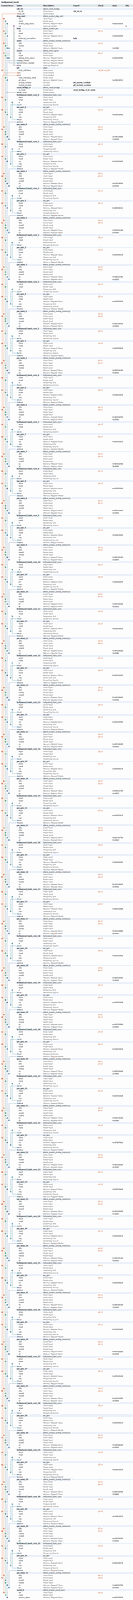
[diagram p0: system contents, whole]
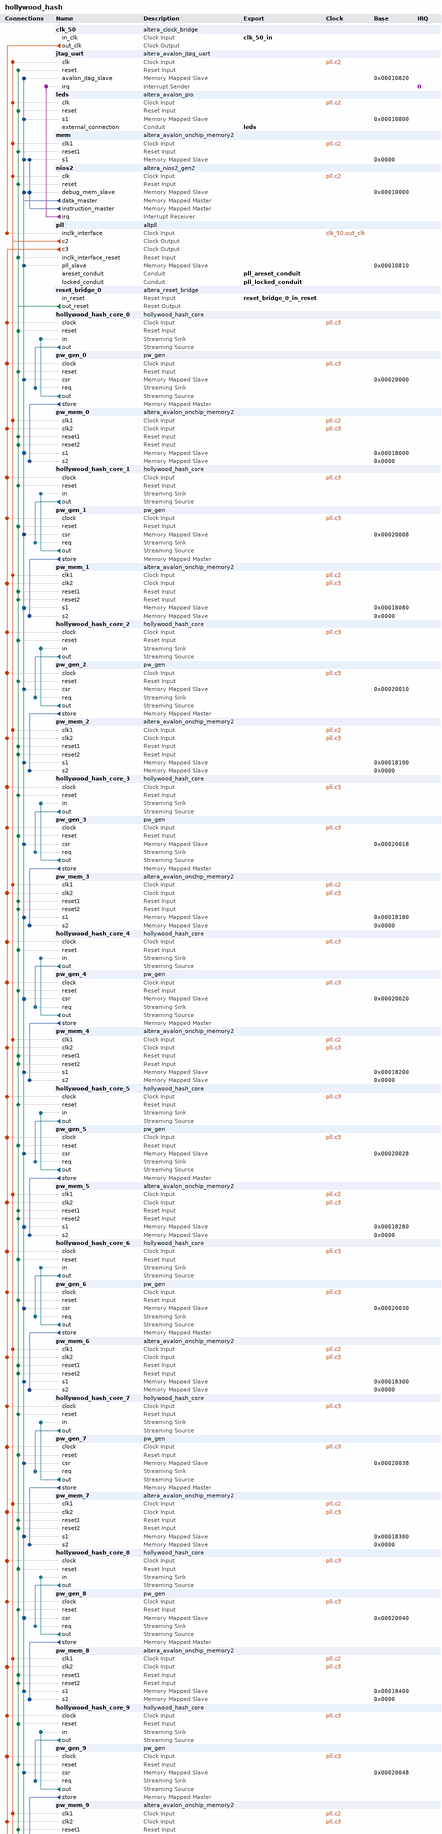
[diagram p1: system contents, upper part]
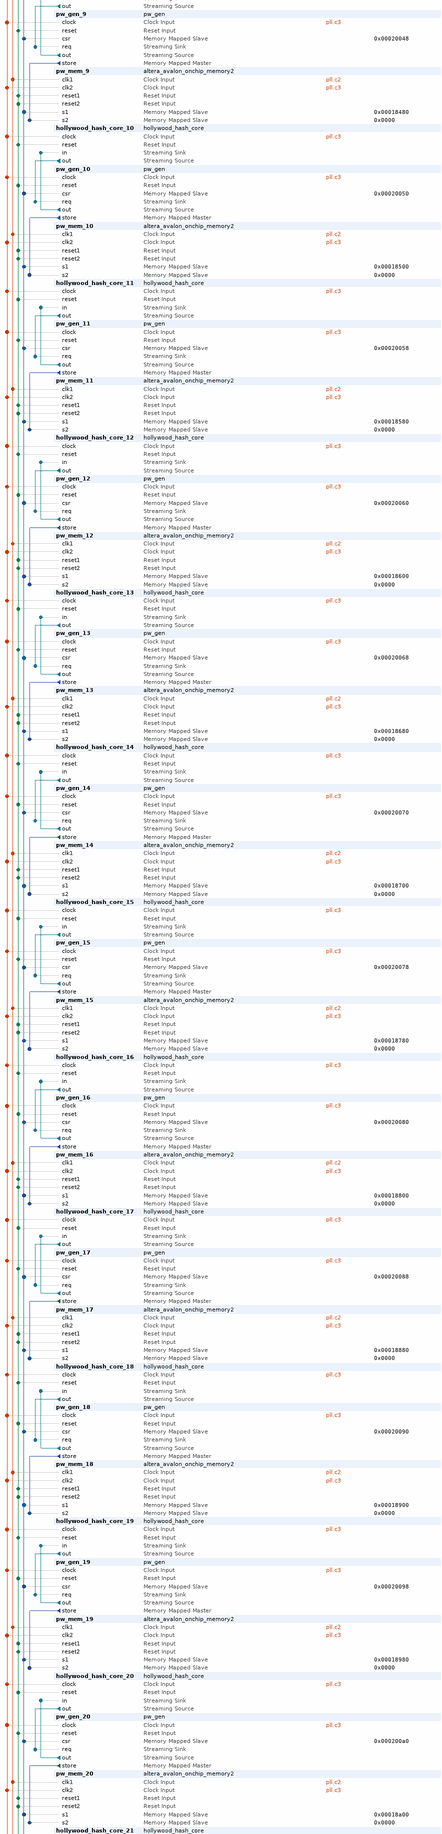
[diagram p2: system contents, middle part]
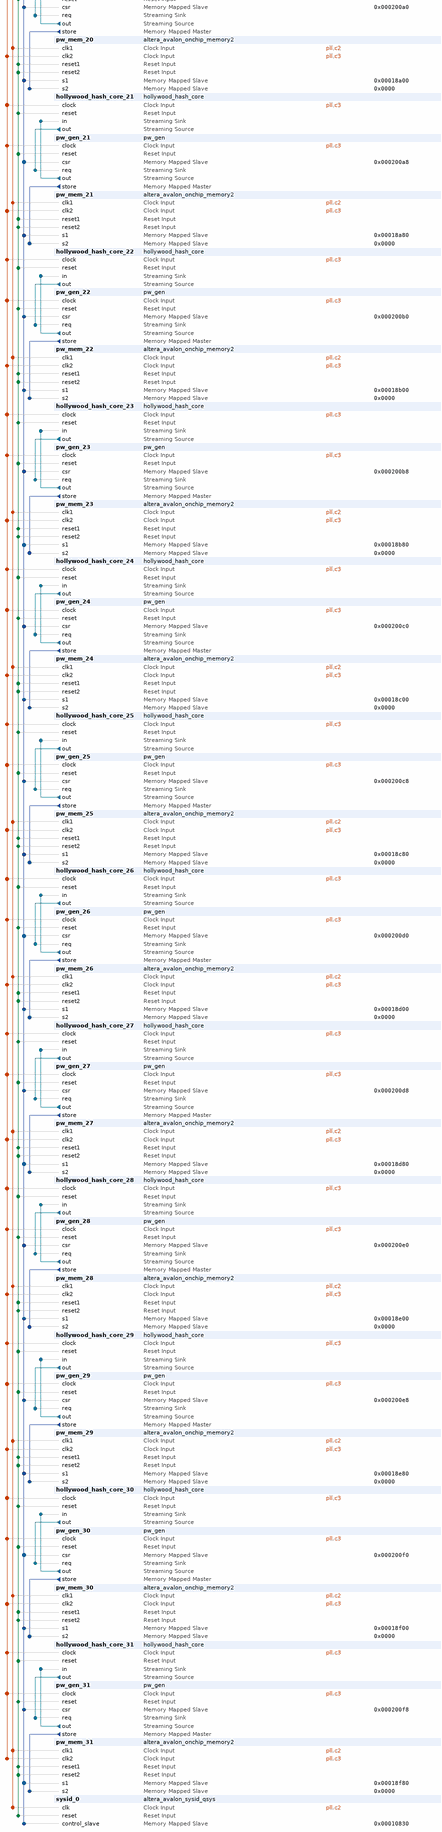
[diagram p3: system contents, lower part]
# Platform Designer (Qsys) system hollywood_hash, MAX 10 10M50DAF484C6GES
# Parameters at their usual value, and those the tool derives, are not listed.
package require -exact qsys 17.1
create_system hollywood_hash
set_project_property DEVICE_FAMILY {MAX 10}
set_project_property DEVICE 10M50DAF484C6GES

add_instance clk_50 altera_clock_bridge 17.1
set_instance_parameter_value clk_50 DERIVED_CLOCK_RATE 0
set_instance_parameter_value clk_50 EXPLICIT_CLOCK_RATE 50

add_instance jtag_uart altera_avalon_jtag_uart 17.1
set_instance_parameter_value jtag_uart simInteractiveOptions INTERACTIVE_ASCII_OUTPUT

add_instance leds altera_avalon_pio 17.1
set_instance_parameter_value leds direction Output
set_instance_parameter_value leds width 5

add_instance mem altera_avalon_onchip_memory2 17.1
set_instance_parameter_value mem dataWidth 32
set_instance_parameter_value mem dualPort false
set_instance_parameter_value mem initMemContent true
set_instance_parameter_value mem initializationFileName onchip_mem.hex
set_instance_parameter_value mem memorySize 32768
set_instance_parameter_value mem slave1Latency 2

add_instance nios2 altera_nios2_gen2 17.1
set_instance_parameter_value nios2 dcache_bursts true
set_instance_parameter_value nios2 dcache_size 4096
set_instance_parameter_value nios2 dividerType srt2
set_instance_parameter_value nios2 exceptionSlave mem.s1
set_instance_parameter_value nios2 icache_burstType Sequential
set_instance_parameter_value nios2 icache_size 16384
set_instance_parameter_value nios2 impl Tiny
set_instance_parameter_value nios2 mul_64_impl 1
set_instance_parameter_value nios2 resetSlave mem.s1

add_instance pll altpll 17.1
set_instance_parameter_value pll CLK0_DIVIDE_BY 5
set_instance_parameter_value pll CLK0_MULTIPLY_BY 1
set_instance_parameter_value pll CLK1_DIVIDE_BY 1
set_instance_parameter_value pll CLK1_DUTY_CYCLE 50
set_instance_parameter_value pll CLK1_MULTIPLY_BY 1
set_instance_parameter_value pll CLK1_PHASE_SHIFT 0
set_instance_parameter_value pll CLK2_DIVIDE_BY 1
set_instance_parameter_value pll CLK2_DUTY_CYCLE 50
set_instance_parameter_value pll CLK2_MULTIPLY_BY 1
set_instance_parameter_value pll CLK2_PHASE_SHIFT 0
set_instance_parameter_value pll CLK3_DIVIDE_BY 2
set_instance_parameter_value pll CLK3_DUTY_CYCLE 50
set_instance_parameter_value pll CLK3_MULTIPLY_BY 11
set_instance_parameter_value pll CLK3_PHASE_SHIFT 0
set_instance_parameter_value pll CLK4_DIVIDE_BY 5
set_instance_parameter_value pll CLK4_DUTY_CYCLE 50
set_instance_parameter_value pll CLK4_MULTIPLY_BY 2
set_instance_parameter_value pll CLK4_PHASE_SHIFT 5000
set_instance_parameter_value pll COMPENSATE_CLOCK CLK2
set_instance_parameter_value pll INCLK0_INPUT_FREQUENCY 20000
set_instance_parameter_value pll PORT_ARESET PORT_USED
set_instance_parameter_value pll PORT_LOCKED PORT_USED
set_instance_parameter_value pll PORT_clk0 PORT_UNUSED
set_instance_parameter_value pll PORT_clk1 PORT_UNUSED
set_instance_parameter_value pll PORT_clk2 PORT_USED
set_instance_parameter_value pll PORT_clk3 PORT_USED

add_instance reset_bridge_0 altera_reset_bridge 17.1
set_instance_parameter_value reset_bridge_0 ACTIVE_LOW_RESET 1
set_instance_parameter_value reset_bridge_0 SYNCHRONOUS_EDGES none

add_instance hollywood_hash_core_0 hollywood_hash_core 1.0
set_instance_parameter_value hollywood_hash_core_0 R4 65201
set_instance_parameter_value hollywood_hash_core_0 R6 37528

add_instance pw_gen_0 pw_gen 1.0
set_instance_parameter_value pw_gen_0 PW1_RESET 0
set_instance_parameter_value pw_gen_0 PW2_RESET 0
set_instance_parameter_value pw_gen_0 PW3_FINAL 7
set_instance_parameter_value pw_gen_0 PW3_RESET 0

add_instance pw_mem_0 altera_avalon_onchip_memory2 17.1
set_instance_parameter_value pw_mem_0 dataWidth 32
set_instance_parameter_value pw_mem_0 dualPort true
set_instance_parameter_value pw_mem_0 enableDiffWidth true
set_instance_parameter_value pw_mem_0 initMemContent false
set_instance_parameter_value pw_mem_0 initializationFileName onchip_mem.hex
set_instance_parameter_value pw_mem_0 memorySize 128
set_instance_parameter_value pw_mem_0 slave1Latency 2
set_instance_parameter_value pw_mem_0 slave2Latency 2

add_instance hollywood_hash_core_1 hollywood_hash_core 1.0
set_instance_parameter_value hollywood_hash_core_1 R4 65201
set_instance_parameter_value hollywood_hash_core_1 R6 37528

add_instance pw_gen_1 pw_gen 1.0
set_instance_parameter_value pw_gen_1 PW1_RESET 0
set_instance_parameter_value pw_gen_1 PW2_RESET 0
set_instance_parameter_value pw_gen_1 PW3_FINAL 15
set_instance_parameter_value pw_gen_1 PW3_RESET 8

add_instance pw_mem_1 altera_avalon_onchip_memory2 17.1
set_instance_parameter_value pw_mem_1 dataWidth 32
set_instance_parameter_value pw_mem_1 dualPort true
set_instance_parameter_value pw_mem_1 enableDiffWidth true
set_instance_parameter_value pw_mem_1 initMemContent false
set_instance_parameter_value pw_mem_1 initializationFileName onchip_mem.hex
set_instance_parameter_value pw_mem_1 memorySize 128
set_instance_parameter_value pw_mem_1 slave1Latency 2
set_instance_parameter_value pw_mem_1 slave2Latency 2

add_instance hollywood_hash_core_2 hollywood_hash_core 1.0
set_instance_parameter_value hollywood_hash_core_2 R4 65201
set_instance_parameter_value hollywood_hash_core_2 R6 37528

add_instance pw_gen_2 pw_gen 1.0
set_instance_parameter_value pw_gen_2 PW1_RESET 0
set_instance_parameter_value pw_gen_2 PW2_RESET 0
set_instance_parameter_value pw_gen_2 PW3_FINAL 23
set_instance_parameter_value pw_gen_2 PW3_RESET 16

add_instance pw_mem_2 altera_avalon_onchip_memory2 17.1
set_instance_parameter_value pw_mem_2 dataWidth 32
set_instance_parameter_value pw_mem_2 dualPort true
set_instance_parameter_value pw_mem_2 enableDiffWidth true
set_instance_parameter_value pw_mem_2 initMemContent false
set_instance_parameter_value pw_mem_2 initializationFileName onchip_mem.hex
set_instance_parameter_value pw_mem_2 memorySize 128
set_instance_parameter_value pw_mem_2 slave1Latency 2
set_instance_parameter_value pw_mem_2 slave2Latency 2

add_instance hollywood_hash_core_3 hollywood_hash_core 1.0
set_instance_parameter_value hollywood_hash_core_3 R4 65201
set_instance_parameter_value hollywood_hash_core_3 R6 37528

add_instance pw_gen_3 pw_gen 1.0
set_instance_parameter_value pw_gen_3 PW1_RESET 0
set_instance_parameter_value pw_gen_3 PW2_RESET 0
set_instance_parameter_value pw_gen_3 PW3_FINAL 31
set_instance_parameter_value pw_gen_3 PW3_RESET 24

add_instance pw_mem_3 altera_avalon_onchip_memory2 17.1
set_instance_parameter_value pw_mem_3 dataWidth 32
set_instance_parameter_value pw_mem_3 dualPort true
set_instance_parameter_value pw_mem_3 enableDiffWidth true
set_instance_parameter_value pw_mem_3 initMemContent false
set_instance_parameter_value pw_mem_3 initializationFileName onchip_mem.hex
set_instance_parameter_value pw_mem_3 memorySize 128
set_instance_parameter_value pw_mem_3 slave1Latency 2
set_instance_parameter_value pw_mem_3 slave2Latency 2

add_instance hollywood_hash_core_4 hollywood_hash_core 1.0
set_instance_parameter_value hollywood_hash_core_4 R4 65201
set_instance_parameter_value hollywood_hash_core_4 R6 37528

add_instance pw_gen_4 pw_gen 1.0
set_instance_parameter_value pw_gen_4 PW1_RESET 0
set_instance_parameter_value pw_gen_4 PW2_RESET 0
set_instance_parameter_value pw_gen_4 PW3_FINAL 39
set_instance_parameter_value pw_gen_4 PW3_RESET 32

add_instance pw_mem_4 altera_avalon_onchip_memory2 17.1
set_instance_parameter_value pw_mem_4 dataWidth 32
set_instance_parameter_value pw_mem_4 dualPort true
set_instance_parameter_value pw_mem_4 enableDiffWidth true
set_instance_parameter_value pw_mem_4 initMemContent false
set_instance_parameter_value pw_mem_4 initializationFileName onchip_mem.hex
set_instance_parameter_value pw_mem_4 memorySize 128
set_instance_parameter_value pw_mem_4 slave1Latency 2
set_instance_parameter_value pw_mem_4 slave2Latency 2

add_instance hollywood_hash_core_5 hollywood_hash_core 1.0
set_instance_parameter_value hollywood_hash_core_5 R4 65201
set_instance_parameter_value hollywood_hash_core_5 R6 37528

add_instance pw_gen_5 pw_gen 1.0
set_instance_parameter_value pw_gen_5 PW1_RESET 0
set_instance_parameter_value pw_gen_5 PW2_RESET 0
set_instance_parameter_value pw_gen_5 PW3_FINAL 47
set_instance_parameter_value pw_gen_5 PW3_RESET 40

add_instance pw_mem_5 altera_avalon_onchip_memory2 17.1
set_instance_parameter_value pw_mem_5 dataWidth 32
set_instance_parameter_value pw_mem_5 dualPort true
set_instance_parameter_value pw_mem_5 enableDiffWidth true
set_instance_parameter_value pw_mem_5 initMemContent false
set_instance_parameter_value pw_mem_5 initializationFileName onchip_mem.hex
set_instance_parameter_value pw_mem_5 memorySize 128
set_instance_parameter_value pw_mem_5 slave1Latency 2
set_instance_parameter_value pw_mem_5 slave2Latency 2

add_instance hollywood_hash_core_6 hollywood_hash_core 1.0
set_instance_parameter_value hollywood_hash_core_6 R4 65201
set_instance_parameter_value hollywood_hash_core_6 R6 37528

add_instance pw_gen_6 pw_gen 1.0
set_instance_parameter_value pw_gen_6 PW1_RESET 0
set_instance_parameter_value pw_gen_6 PW2_RESET 0
set_instance_parameter_value pw_gen_6 PW3_FINAL 55
set_instance_parameter_value pw_gen_6 PW3_RESET 48

add_instance pw_mem_6 altera_avalon_onchip_memory2 17.1
set_instance_parameter_value pw_mem_6 dataWidth 32
set_instance_parameter_value pw_mem_6 dualPort true
set_instance_parameter_value pw_mem_6 enableDiffWidth true
set_instance_parameter_value pw_mem_6 initMemContent false
set_instance_parameter_value pw_mem_6 initializationFileName onchip_mem.hex
set_instance_parameter_value pw_mem_6 memorySize 128
set_instance_parameter_value pw_mem_6 slave1Latency 2
set_instance_parameter_value pw_mem_6 slave2Latency 2

add_instance hollywood_hash_core_7 hollywood_hash_core 1.0
set_instance_parameter_value hollywood_hash_core_7 R4 65201
set_instance_parameter_value hollywood_hash_core_7 R6 37528

add_instance pw_gen_7 pw_gen 1.0
set_instance_parameter_value pw_gen_7 PW1_RESET 0
set_instance_parameter_value pw_gen_7 PW2_RESET 0
set_instance_parameter_value pw_gen_7 PW3_FINAL 63
set_instance_parameter_value pw_gen_7 PW3_RESET 56

add_instance pw_mem_7 altera_avalon_onchip_memory2 17.1
set_instance_parameter_value pw_mem_7 dataWidth 32
set_instance_parameter_value pw_mem_7 dualPort true
set_instance_parameter_value pw_mem_7 enableDiffWidth true
set_instance_parameter_value pw_mem_7 initMemContent false
set_instance_parameter_value pw_mem_7 initializationFileName onchip_mem.hex
set_instance_parameter_value pw_mem_7 memorySize 128
set_instance_parameter_value pw_mem_7 slave1Latency 2
set_instance_parameter_value pw_mem_7 slave2Latency 2

add_instance hollywood_hash_core_8 hollywood_hash_core 1.0
set_instance_parameter_value hollywood_hash_core_8 R4 65201
set_instance_parameter_value hollywood_hash_core_8 R6 37528

add_instance pw_gen_8 pw_gen 1.0
set_instance_parameter_value pw_gen_8 PW1_RESET 0
set_instance_parameter_value pw_gen_8 PW2_RESET 0
set_instance_parameter_value pw_gen_8 PW3_FINAL 71
set_instance_parameter_value pw_gen_8 PW3_RESET 64

add_instance pw_mem_8 altera_avalon_onchip_memory2 17.1
set_instance_parameter_value pw_mem_8 dataWidth 32
set_instance_parameter_value pw_mem_8 dualPort true
set_instance_parameter_value pw_mem_8 enableDiffWidth true
set_instance_parameter_value pw_mem_8 initMemContent false
set_instance_parameter_value pw_mem_8 initializationFileName onchip_mem.hex
set_instance_parameter_value pw_mem_8 memorySize 128
set_instance_parameter_value pw_mem_8 slave1Latency 2
set_instance_parameter_value pw_mem_8 slave2Latency 2

add_instance hollywood_hash_core_9 hollywood_hash_core 1.0
set_instance_parameter_value hollywood_hash_core_9 R4 65201
set_instance_parameter_value hollywood_hash_core_9 R6 37528

add_instance pw_gen_9 pw_gen 1.0
set_instance_parameter_value pw_gen_9 PW1_RESET 0
set_instance_parameter_value pw_gen_9 PW2_RESET 0
set_instance_parameter_value pw_gen_9 PW3_FINAL 79
set_instance_parameter_value pw_gen_9 PW3_RESET 72

add_instance pw_mem_9 altera_avalon_onchip_memory2 17.1
set_instance_parameter_value pw_mem_9 dataWidth 32
set_instance_parameter_value pw_mem_9 dualPort true
set_instance_parameter_value pw_mem_9 enableDiffWidth true
set_instance_parameter_value pw_mem_9 initMemContent false
set_instance_parameter_value pw_mem_9 initializationFileName onchip_mem.hex
set_instance_parameter_value pw_mem_9 memorySize 128
set_instance_parameter_value pw_mem_9 slave1Latency 2
set_instance_parameter_value pw_mem_9 slave2Latency 2

add_instance hollywood_hash_core_10 hollywood_hash_core 1.0
set_instance_parameter_value hollywood_hash_core_10 R4 65201
set_instance_parameter_value hollywood_hash_core_10 R6 37528

add_instance pw_gen_10 pw_gen 1.0
set_instance_parameter_value pw_gen_10 PW1_RESET 0
set_instance_parameter_value pw_gen_10 PW2_RESET 0
set_instance_parameter_value pw_gen_10 PW3_FINAL 87
set_instance_parameter_value pw_gen_10 PW3_RESET 80

add_instance pw_mem_10 altera_avalon_onchip_memory2 17.1
set_instance_parameter_value pw_mem_10 dataWidth 32
set_instance_parameter_value pw_mem_10 dualPort true
set_instance_parameter_value pw_mem_10 enableDiffWidth true
set_instance_parameter_value pw_mem_10 initMemContent false
set_instance_parameter_value pw_mem_10 initializationFileName onchip_mem.hex
set_instance_parameter_value pw_mem_10 memorySize 128
set_instance_parameter_value pw_mem_10 slave1Latency 2
set_instance_parameter_value pw_mem_10 slave2Latency 2

add_instance hollywood_hash_core_11 hollywood_hash_core 1.0
set_instance_parameter_value hollywood_hash_core_11 R4 65201
set_instance_parameter_value hollywood_hash_core_11 R6 37528

add_instance pw_gen_11 pw_gen 1.0
set_instance_parameter_value pw_gen_11 PW1_RESET 0
set_instance_parameter_value pw_gen_11 PW2_RESET 0
set_instance_parameter_value pw_gen_11 PW3_FINAL 95
set_instance_parameter_value pw_gen_11 PW3_RESET 88

add_instance pw_mem_11 altera_avalon_onchip_memory2 17.1
set_instance_parameter_value pw_mem_11 dataWidth 32
set_instance_parameter_value pw_mem_11 dualPort true
set_instance_parameter_value pw_mem_11 enableDiffWidth true
set_instance_parameter_value pw_mem_11 initMemContent false
set_instance_parameter_value pw_mem_11 initializationFileName onchip_mem.hex
set_instance_parameter_value pw_mem_11 memorySize 128
set_instance_parameter_value pw_mem_11 slave1Latency 2
set_instance_parameter_value pw_mem_11 slave2Latency 2

add_instance hollywood_hash_core_12 hollywood_hash_core 1.0
set_instance_parameter_value hollywood_hash_core_12 R4 65201
set_instance_parameter_value hollywood_hash_core_12 R6 37528

add_instance pw_gen_12 pw_gen 1.0
set_instance_parameter_value pw_gen_12 PW1_RESET 0
set_instance_parameter_value pw_gen_12 PW2_RESET 0
set_instance_parameter_value pw_gen_12 PW3_FINAL 103
set_instance_parameter_value pw_gen_12 PW3_RESET 96

add_instance pw_mem_12 altera_avalon_onchip_memory2 17.1
set_instance_parameter_value pw_mem_12 dataWidth 32
set_instance_parameter_value pw_mem_12 dualPort true
set_instance_parameter_value pw_mem_12 enableDiffWidth true
set_instance_parameter_value pw_mem_12 initMemContent false
set_instance_parameter_value pw_mem_12 initializationFileName onchip_mem.hex
set_instance_parameter_value pw_mem_12 memorySize 128
set_instance_parameter_value pw_mem_12 slave1Latency 2
set_instance_parameter_value pw_mem_12 slave2Latency 2

add_instance hollywood_hash_core_13 hollywood_hash_core 1.0
set_instance_parameter_value hollywood_hash_core_13 R4 65201
set_instance_parameter_value hollywood_hash_core_13 R6 37528

add_instance pw_gen_13 pw_gen 1.0
set_instance_parameter_value pw_gen_13 PW1_RESET 0
set_instance_parameter_value pw_gen_13 PW2_RESET 0
set_instance_parameter_value pw_gen_13 PW3_FINAL 111
set_instance_parameter_value pw_gen_13 PW3_RESET 104

add_instance pw_mem_13 altera_avalon_onchip_memory2 17.1
set_instance_parameter_value pw_mem_13 dataWidth 32
set_instance_parameter_value pw_mem_13 dualPort true
set_instance_parameter_value pw_mem_13 enableDiffWidth true
set_instance_parameter_value pw_mem_13 initMemContent false
set_instance_parameter_value pw_mem_13 initializationFileName onchip_mem.hex
set_instance_parameter_value pw_mem_13 memorySize 128
set_instance_parameter_value pw_mem_13 slave1Latency 2
set_instance_parameter_value pw_mem_13 slave2Latency 2

add_instance hollywood_hash_core_14 hollywood_hash_core 1.0
set_instance_parameter_value hollywood_hash_core_14 R4 65201
set_instance_parameter_value hollywood_hash_core_14 R6 37528

add_instance pw_gen_14 pw_gen 1.0
set_instance_parameter_value pw_gen_14 PW1_RESET 0
set_instance_parameter_value pw_gen_14 PW2_RESET 0
set_instance_parameter_value pw_gen_14 PW3_FINAL 119
set_instance_parameter_value pw_gen_14 PW3_RESET 112

add_instance pw_mem_14 altera_avalon_onchip_memory2 17.1
set_instance_parameter_value pw_mem_14 dataWidth 32
set_instance_parameter_value pw_mem_14 dualPort true
set_instance_parameter_value pw_mem_14 enableDiffWidth true
set_instance_parameter_value pw_mem_14 initMemContent false
set_instance_parameter_value pw_mem_14 initializationFileName onchip_mem.hex
set_instance_parameter_value pw_mem_14 memorySize 128
set_instance_parameter_value pw_mem_14 slave1Latency 2
set_instance_parameter_value pw_mem_14 slave2Latency 2

add_instance hollywood_hash_core_15 hollywood_hash_core 1.0
set_instance_parameter_value hollywood_hash_core_15 R4 65201
set_instance_parameter_value hollywood_hash_core_15 R6 37528

add_instance pw_gen_15 pw_gen 1.0
set_instance_parameter_value pw_gen_15 PW1_RESET 0
set_instance_parameter_value pw_gen_15 PW2_RESET 0
set_instance_parameter_value pw_gen_15 PW3_FINAL 127
set_instance_parameter_value pw_gen_15 PW3_RESET 120

add_instance pw_mem_15 altera_avalon_onchip_memory2 17.1
set_instance_parameter_value pw_mem_15 dataWidth 32
set_instance_parameter_value pw_mem_15 dualPort true
set_instance_parameter_value pw_mem_15 enableDiffWidth true
set_instance_parameter_value pw_mem_15 initMemContent false
set_instance_parameter_value pw_mem_15 initializationFileName onchip_mem.hex
set_instance_parameter_value pw_mem_15 memorySize 128
set_instance_parameter_value pw_mem_15 slave1Latency 2
set_instance_parameter_value pw_mem_15 slave2Latency 2

add_instance hollywood_hash_core_16 hollywood_hash_core 1.0
set_instance_parameter_value hollywood_hash_core_16 R4 65201
set_instance_parameter_value hollywood_hash_core_16 R6 37528

add_instance pw_gen_16 pw_gen 1.0
set_instance_parameter_value pw_gen_16 PW1_RESET 0
set_instance_parameter_value pw_gen_16 PW2_RESET 0
set_instance_parameter_value pw_gen_16 PW3_FINAL 135
set_instance_parameter_value pw_gen_16 PW3_RESET 128

add_instance pw_mem_16 altera_avalon_onchip_memory2 17.1
set_instance_parameter_value pw_mem_16 dataWidth 32
set_instance_parameter_value pw_mem_16 dualPort true
set_instance_parameter_value pw_mem_16 enableDiffWidth true
set_instance_parameter_value pw_mem_16 initMemContent false
set_instance_parameter_value pw_mem_16 initializationFileName onchip_mem.hex
set_instance_parameter_value pw_mem_16 memorySize 128
set_instance_parameter_value pw_mem_16 slave1Latency 2
set_instance_parameter_value pw_mem_16 slave2Latency 2

add_instance hollywood_hash_core_17 hollywood_hash_core 1.0
set_instance_parameter_value hollywood_hash_core_17 R4 65201
set_instance_parameter_value hollywood_hash_core_17 R6 37528

add_instance pw_gen_17 pw_gen 1.0
set_instance_parameter_value pw_gen_17 PW1_RESET 0
set_instance_parameter_value pw_gen_17 PW2_RESET 0
set_instance_parameter_value pw_gen_17 PW3_FINAL 143
set_instance_parameter_value pw_gen_17 PW3_RESET 136

add_instance pw_mem_17 altera_avalon_onchip_memory2 17.1
set_instance_parameter_value pw_mem_17 dataWidth 32
set_instance_parameter_value pw_mem_17 dualPort true
set_instance_parameter_value pw_mem_17 enableDiffWidth true
set_instance_parameter_value pw_mem_17 initMemContent false
set_instance_parameter_value pw_mem_17 initializationFileName onchip_mem.hex
set_instance_parameter_value pw_mem_17 memorySize 128
set_instance_parameter_value pw_mem_17 slave1Latency 2
set_instance_parameter_value pw_mem_17 slave2Latency 2

add_instance hollywood_hash_core_18 hollywood_hash_core 1.0
set_instance_parameter_value hollywood_hash_core_18 R4 65201
set_instance_parameter_value hollywood_hash_core_18 R6 37528

add_instance pw_gen_18 pw_gen 1.0
set_instance_parameter_value pw_gen_18 PW1_RESET 0
set_instance_parameter_value pw_gen_18 PW2_RESET 0
set_instance_parameter_value pw_gen_18 PW3_FINAL 151
set_instance_parameter_value pw_gen_18 PW3_RESET 144

add_instance pw_mem_18 altera_avalon_onchip_memory2 17.1
set_instance_parameter_value pw_mem_18 dataWidth 32
set_instance_parameter_value pw_mem_18 dualPort true
set_instance_parameter_value pw_mem_18 enableDiffWidth true
set_instance_parameter_value pw_mem_18 initMemContent false
set_instance_parameter_value pw_mem_18 initializationFileName onchip_mem.hex
set_instance_parameter_value pw_mem_18 memorySize 128
set_instance_parameter_value pw_mem_18 slave1Latency 2
set_instance_parameter_value pw_mem_18 slave2Latency 2

add_instance hollywood_hash_core_19 hollywood_hash_core 1.0
set_instance_parameter_value hollywood_hash_core_19 R4 65201
set_instance_parameter_value hollywood_hash_core_19 R6 37528

add_instance pw_gen_19 pw_gen 1.0
set_instance_parameter_value pw_gen_19 PW1_RESET 0
set_instance_parameter_value pw_gen_19 PW2_RESET 0
set_instance_parameter_value pw_gen_19 PW3_FINAL 159
set_instance_parameter_value pw_gen_19 PW3_RESET 152

add_instance pw_mem_19 altera_avalon_onchip_memory2 17.1
set_instance_parameter_value pw_mem_19 dataWidth 32
set_instance_parameter_value pw_mem_19 dualPort true
set_instance_parameter_value pw_mem_19 enableDiffWidth true
set_instance_parameter_value pw_mem_19 initMemContent false
set_instance_parameter_value pw_mem_19 initializationFileName onchip_mem.hex
set_instance_parameter_value pw_mem_19 memorySize 128
set_instance_parameter_value pw_mem_19 slave1Latency 2
set_instance_parameter_value pw_mem_19 slave2Latency 2

add_instance hollywood_hash_core_20 hollywood_hash_core 1.0
set_instance_parameter_value hollywood_hash_core_20 R4 65201
set_instance_parameter_value hollywood_hash_core_20 R6 37528

add_instance pw_gen_20 pw_gen 1.0
set_instance_parameter_value pw_gen_20 PW1_RESET 0
set_instance_parameter_value pw_gen_20 PW2_RESET 0
set_instance_parameter_value pw_gen_20 PW3_FINAL 167
set_instance_parameter_value pw_gen_20 PW3_RESET 160

add_instance pw_mem_20 altera_avalon_onchip_memory2 17.1
set_instance_parameter_value pw_mem_20 dataWidth 32
set_instance_parameter_value pw_mem_20 dualPort true
set_instance_parameter_value pw_mem_20 enableDiffWidth true
set_instance_parameter_value pw_mem_20 initMemContent false
set_instance_parameter_value pw_mem_20 initializationFileName onchip_mem.hex
set_instance_parameter_value pw_mem_20 memorySize 128
set_instance_parameter_value pw_mem_20 slave1Latency 2
set_instance_parameter_value pw_mem_20 slave2Latency 2

add_instance hollywood_hash_core_21 hollywood_hash_core 1.0
set_instance_parameter_value hollywood_hash_core_21 R4 65201
set_instance_parameter_value hollywood_hash_core_21 R6 37528

add_instance pw_gen_21 pw_gen 1.0
set_instance_parameter_value pw_gen_21 PW1_RESET 0
set_instance_parameter_value pw_gen_21 PW2_RESET 0
set_instance_parameter_value pw_gen_21 PW3_FINAL 175
set_instance_parameter_value pw_gen_21 PW3_RESET 168

add_instance pw_mem_21 altera_avalon_onchip_memory2 17.1
set_instance_parameter_value pw_mem_21 dataWidth 32
set_instance_parameter_value pw_mem_21 dualPort true
set_instance_parameter_value pw_mem_21 enableDiffWidth true
set_instance_parameter_value pw_mem_21 initMemContent false
set_instance_parameter_value pw_mem_21 initializationFileName onchip_mem.hex
set_instance_parameter_value pw_mem_21 memorySize 128
set_instance_parameter_value pw_mem_21 slave1Latency 2
set_instance_parameter_value pw_mem_21 slave2Latency 2

add_instance hollywood_hash_core_22 hollywood_hash_core 1.0
set_instance_parameter_value hollywood_hash_core_22 R4 65201
set_instance_parameter_value hollywood_hash_core_22 R6 37528

add_instance pw_gen_22 pw_gen 1.0
set_instance_parameter_value pw_gen_22 PW1_RESET 0
set_instance_parameter_value pw_gen_22 PW2_RESET 0
set_instance_parameter_value pw_gen_22 PW3_FINAL 183
set_instance_parameter_value pw_gen_22 PW3_RESET 176

add_instance pw_mem_22 altera_avalon_onchip_memory2 17.1
set_instance_parameter_value pw_mem_22 dataWidth 32
set_instance_parameter_value pw_mem_22 dualPort true
set_instance_parameter_value pw_mem_22 enableDiffWidth true
set_instance_parameter_value pw_mem_22 initMemContent false
set_instance_parameter_value pw_mem_22 initializationFileName onchip_mem.hex
set_instance_parameter_value pw_mem_22 memorySize 128
set_instance_parameter_value pw_mem_22 slave1Latency 2
set_instance_parameter_value pw_mem_22 slave2Latency 2

add_instance hollywood_hash_core_23 hollywood_hash_core 1.0
set_instance_parameter_value hollywood_hash_core_23 R4 65201
set_instance_parameter_value hollywood_hash_core_23 R6 37528

add_instance pw_gen_23 pw_gen 1.0
set_instance_parameter_value pw_gen_23 PW1_RESET 0
set_instance_parameter_value pw_gen_23 PW2_RESET 0
set_instance_parameter_value pw_gen_23 PW3_FINAL 191
set_instance_parameter_value pw_gen_23 PW3_RESET 184

add_instance pw_mem_23 altera_avalon_onchip_memory2 17.1
set_instance_parameter_value pw_mem_23 dataWidth 32
set_instance_parameter_value pw_mem_23 dualPort true
set_instance_parameter_value pw_mem_23 enableDiffWidth true
set_instance_parameter_value pw_mem_23 initMemContent false
set_instance_parameter_value pw_mem_23 initializationFileName onchip_mem.hex
set_instance_parameter_value pw_mem_23 memorySize 128
set_instance_parameter_value pw_mem_23 slave1Latency 2
set_instance_parameter_value pw_mem_23 slave2Latency 2

add_instance hollywood_hash_core_24 hollywood_hash_core 1.0
set_instance_parameter_value hollywood_hash_core_24 R4 65201
set_instance_parameter_value hollywood_hash_core_24 R6 37528

add_instance pw_gen_24 pw_gen 1.0
set_instance_parameter_value pw_gen_24 PW1_RESET 0
set_instance_parameter_value pw_gen_24 PW2_RESET 0
set_instance_parameter_value pw_gen_24 PW3_FINAL 199
set_instance_parameter_value pw_gen_24 PW3_RESET 192

add_instance pw_mem_24 altera_avalon_onchip_memory2 17.1
set_instance_parameter_value pw_mem_24 dataWidth 32
set_instance_parameter_value pw_mem_24 dualPort true
set_instance_parameter_value pw_mem_24 enableDiffWidth true
set_instance_parameter_value pw_mem_24 initMemContent false
set_instance_parameter_value pw_mem_24 initializationFileName onchip_mem.hex
set_instance_parameter_value pw_mem_24 memorySize 128
set_instance_parameter_value pw_mem_24 slave1Latency 2
set_instance_parameter_value pw_mem_24 slave2Latency 2

add_instance hollywood_hash_core_25 hollywood_hash_core 1.0
set_instance_parameter_value hollywood_hash_core_25 R4 65201
set_instance_parameter_value hollywood_hash_core_25 R6 37528

add_instance pw_gen_25 pw_gen 1.0
set_instance_parameter_value pw_gen_25 PW1_RESET 0
set_instance_parameter_value pw_gen_25 PW2_RESET 0
set_instance_parameter_value pw_gen_25 PW3_FINAL 207
set_instance_parameter_value pw_gen_25 PW3_RESET 200

add_instance pw_mem_25 altera_avalon_onchip_memory2 17.1
set_instance_parameter_value pw_mem_25 dataWidth 32
set_instance_parameter_value pw_mem_25 dualPort true
set_instance_parameter_value pw_mem_25 enableDiffWidth true
set_instance_parameter_value pw_mem_25 initMemContent false
set_instance_parameter_value pw_mem_25 initializationFileName onchip_mem.hex
set_instance_parameter_value pw_mem_25 memorySize 128
set_instance_parameter_value pw_mem_25 slave1Latency 2
set_instance_parameter_value pw_mem_25 slave2Latency 2

add_instance hollywood_hash_core_26 hollywood_hash_core 1.0
set_instance_parameter_value hollywood_hash_core_26 R4 65201
set_instance_parameter_value hollywood_hash_core_26 R6 37528

add_instance pw_gen_26 pw_gen 1.0
set_instance_parameter_value pw_gen_26 PW1_RESET 0
set_instance_parameter_value pw_gen_26 PW2_RESET 0
set_instance_parameter_value pw_gen_26 PW3_FINAL 215
set_instance_parameter_value pw_gen_26 PW3_RESET 208

add_instance pw_mem_26 altera_avalon_onchip_memory2 17.1
set_instance_parameter_value pw_mem_26 dataWidth 32
set_instance_parameter_value pw_mem_26 dualPort true
set_instance_parameter_value pw_mem_26 enableDiffWidth true
set_instance_parameter_value pw_mem_26 initMemContent false
set_instance_parameter_value pw_mem_26 initializationFileName onchip_mem.hex
set_instance_parameter_value pw_mem_26 memorySize 128
set_instance_parameter_value pw_mem_26 slave1Latency 2
set_instance_parameter_value pw_mem_26 slave2Latency 2

add_instance hollywood_hash_core_27 hollywood_hash_core 1.0
set_instance_parameter_value hollywood_hash_core_27 R4 65201
set_instance_parameter_value hollywood_hash_core_27 R6 37528

add_instance pw_gen_27 pw_gen 1.0
set_instance_parameter_value pw_gen_27 PW1_RESET 0
set_instance_parameter_value pw_gen_27 PW2_RESET 0
set_instance_parameter_value pw_gen_27 PW3_FINAL 223
set_instance_parameter_value pw_gen_27 PW3_RESET 216

add_instance pw_mem_27 altera_avalon_onchip_memory2 17.1
set_instance_parameter_value pw_mem_27 dataWidth 32
set_instance_parameter_value pw_mem_27 dualPort true
set_instance_parameter_value pw_mem_27 enableDiffWidth true
set_instance_parameter_value pw_mem_27 initMemContent false
set_instance_parameter_value pw_mem_27 initializationFileName onchip_mem.hex
set_instance_parameter_value pw_mem_27 memorySize 128
set_instance_parameter_value pw_mem_27 slave1Latency 2
set_instance_parameter_value pw_mem_27 slave2Latency 2

add_instance hollywood_hash_core_28 hollywood_hash_core 1.0
set_instance_parameter_value hollywood_hash_core_28 R4 65201
set_instance_parameter_value hollywood_hash_core_28 R6 37528

add_instance pw_gen_28 pw_gen 1.0
set_instance_parameter_value pw_gen_28 PW1_RESET 0
set_instance_parameter_value pw_gen_28 PW2_RESET 0
set_instance_parameter_value pw_gen_28 PW3_FINAL 231
set_instance_parameter_value pw_gen_28 PW3_RESET 224

add_instance pw_mem_28 altera_avalon_onchip_memory2 17.1
set_instance_parameter_value pw_mem_28 dataWidth 32
set_instance_parameter_value pw_mem_28 dualPort true
set_instance_parameter_value pw_mem_28 enableDiffWidth true
set_instance_parameter_value pw_mem_28 initMemContent false
set_instance_parameter_value pw_mem_28 initializationFileName onchip_mem.hex
set_instance_parameter_value pw_mem_28 memorySize 128
set_instance_parameter_value pw_mem_28 slave1Latency 2
set_instance_parameter_value pw_mem_28 slave2Latency 2

add_instance hollywood_hash_core_29 hollywood_hash_core 1.0
set_instance_parameter_value hollywood_hash_core_29 R4 65201
set_instance_parameter_value hollywood_hash_core_29 R6 37528

add_instance pw_gen_29 pw_gen 1.0
set_instance_parameter_value pw_gen_29 PW1_RESET 0
set_instance_parameter_value pw_gen_29 PW2_RESET 0
set_instance_parameter_value pw_gen_29 PW3_FINAL 239
set_instance_parameter_value pw_gen_29 PW3_RESET 232

add_instance pw_mem_29 altera_avalon_onchip_memory2 17.1
set_instance_parameter_value pw_mem_29 dataWidth 32
set_instance_parameter_value pw_mem_29 dualPort true
set_instance_parameter_value pw_mem_29 enableDiffWidth true
set_instance_parameter_value pw_mem_29 initMemContent false
set_instance_parameter_value pw_mem_29 initializationFileName onchip_mem.hex
set_instance_parameter_value pw_mem_29 memorySize 128
set_instance_parameter_value pw_mem_29 slave1Latency 2
set_instance_parameter_value pw_mem_29 slave2Latency 2

add_instance hollywood_hash_core_30 hollywood_hash_core 1.0
set_instance_parameter_value hollywood_hash_core_30 R4 65201
set_instance_parameter_value hollywood_hash_core_30 R6 37528

add_instance pw_gen_30 pw_gen 1.0
set_instance_parameter_value pw_gen_30 PW1_RESET 0
set_instance_parameter_value pw_gen_30 PW2_RESET 0
set_instance_parameter_value pw_gen_30 PW3_FINAL 247
set_instance_parameter_value pw_gen_30 PW3_RESET 240

add_instance pw_mem_30 altera_avalon_onchip_memory2 17.1
set_instance_parameter_value pw_mem_30 dataWidth 32
set_instance_parameter_value pw_mem_30 dualPort true
set_instance_parameter_value pw_mem_30 enableDiffWidth true
set_instance_parameter_value pw_mem_30 initMemContent false
set_instance_parameter_value pw_mem_30 initializationFileName onchip_mem.hex
set_instance_parameter_value pw_mem_30 memorySize 128
set_instance_parameter_value pw_mem_30 slave1Latency 2
set_instance_parameter_value pw_mem_30 slave2Latency 2

add_instance hollywood_hash_core_31 hollywood_hash_core 1.0
set_instance_parameter_value hollywood_hash_core_31 R4 65201
set_instance_parameter_value hollywood_hash_core_31 R6 37528

add_instance pw_gen_31 pw_gen 1.0
set_instance_parameter_value pw_gen_31 PW1_RESET 0
set_instance_parameter_value pw_gen_31 PW2_RESET 0
set_instance_parameter_value pw_gen_31 PW3_FINAL 255
set_instance_parameter_value pw_gen_31 PW3_RESET 248

add_instance pw_mem_31 altera_avalon_onchip_memory2 17.1
set_instance_parameter_value pw_mem_31 dataWidth 32
set_instance_parameter_value pw_mem_31 dualPort true
set_instance_parameter_value pw_mem_31 enableDiffWidth true
set_instance_parameter_value pw_mem_31 initMemContent false
set_instance_parameter_value pw_mem_31 initializationFileName onchip_mem.hex
set_instance_parameter_value pw_mem_31 memorySize 128
set_instance_parameter_value pw_mem_31 slave1Latency 2
set_instance_parameter_value pw_mem_31 slave2Latency 2

add_instance sysid_0 altera_avalon_sysid_qsys 17.1
set_instance_parameter_value sysid_0 id -21917032

# connections
add_connection clk_50.out_clk pll.inclk_interface clock
add_connection pll.c2 jtag_uart.clk clock
add_connection pll.c2 leds.clk clock
add_connection pll.c2 mem.clk1 clock
add_connection pll.c2 nios2.clk clock
add_connection pll.c2 pw_mem_0.clk1 clock
add_connection pll.c2 pw_mem_1.clk1 clock
add_connection pll.c2 pw_mem_2.clk1 clock
add_connection pll.c2 pw_mem_3.clk1 clock
add_connection pll.c2 pw_mem_4.clk1 clock
add_connection pll.c2 pw_mem_5.clk1 clock
add_connection pll.c2 pw_mem_6.clk1 clock
add_connection pll.c2 pw_mem_7.clk1 clock
add_connection pll.c2 pw_mem_8.clk1 clock
add_connection pll.c2 pw_mem_9.clk1 clock
add_connection pll.c2 pw_mem_10.clk1 clock
add_connection pll.c2 pw_mem_11.clk1 clock
add_connection pll.c2 pw_mem_12.clk1 clock
add_connection pll.c2 pw_mem_13.clk1 clock
add_connection pll.c2 pw_mem_14.clk1 clock
add_connection pll.c2 pw_mem_15.clk1 clock
add_connection pll.c2 pw_mem_16.clk1 clock
add_connection pll.c2 pw_mem_17.clk1 clock
add_connection pll.c2 pw_mem_18.clk1 clock
add_connection pll.c2 pw_mem_19.clk1 clock
add_connection pll.c2 pw_mem_20.clk1 clock
add_connection pll.c2 pw_mem_21.clk1 clock
add_connection pll.c2 pw_mem_22.clk1 clock
add_connection pll.c2 pw_mem_23.clk1 clock
add_connection pll.c2 pw_mem_24.clk1 clock
add_connection pll.c2 pw_mem_25.clk1 clock
add_connection pll.c2 pw_mem_26.clk1 clock
add_connection pll.c2 pw_mem_27.clk1 clock
add_connection pll.c2 pw_mem_28.clk1 clock
add_connection pll.c2 pw_mem_29.clk1 clock
add_connection pll.c2 pw_mem_30.clk1 clock
add_connection pll.c2 pw_mem_31.clk1 clock
add_connection pll.c2 sysid_0.clk clock
add_connection pll.c3 hollywood_hash_core_0.clock clock
add_connection pll.c3 hollywood_hash_core_1.clock clock
add_connection pll.c3 hollywood_hash_core_2.clock clock
add_connection pll.c3 hollywood_hash_core_3.clock clock
add_connection pll.c3 hollywood_hash_core_4.clock clock
add_connection pll.c3 hollywood_hash_core_5.clock clock
add_connection pll.c3 hollywood_hash_core_6.clock clock
add_connection pll.c3 hollywood_hash_core_7.clock clock
add_connection pll.c3 hollywood_hash_core_8.clock clock
add_connection pll.c3 hollywood_hash_core_9.clock clock
add_connection pll.c3 hollywood_hash_core_10.clock clock
add_connection pll.c3 hollywood_hash_core_11.clock clock
add_connection pll.c3 hollywood_hash_core_12.clock clock
add_connection pll.c3 hollywood_hash_core_13.clock clock
add_connection pll.c3 hollywood_hash_core_14.clock clock
add_connection pll.c3 hollywood_hash_core_15.clock clock
add_connection pll.c3 hollywood_hash_core_16.clock clock
add_connection pll.c3 hollywood_hash_core_17.clock clock
add_connection pll.c3 hollywood_hash_core_18.clock clock
add_connection pll.c3 hollywood_hash_core_19.clock clock
add_connection pll.c3 hollywood_hash_core_20.clock clock
add_connection pll.c3 hollywood_hash_core_21.clock clock
add_connection pll.c3 hollywood_hash_core_22.clock clock
add_connection pll.c3 hollywood_hash_core_23.clock clock
add_connection pll.c3 hollywood_hash_core_24.clock clock
add_connection pll.c3 hollywood_hash_core_25.clock clock
add_connection pll.c3 hollywood_hash_core_26.clock clock
add_connection pll.c3 hollywood_hash_core_27.clock clock
add_connection pll.c3 hollywood_hash_core_28.clock clock
add_connection pll.c3 hollywood_hash_core_29.clock clock
add_connection pll.c3 hollywood_hash_core_30.clock clock
add_connection pll.c3 hollywood_hash_core_31.clock clock
add_connection pll.c3 pw_gen_0.clock clock
add_connection pll.c3 pw_gen_1.clock clock
add_connection pll.c3 pw_gen_2.clock clock
add_connection pll.c3 pw_gen_3.clock clock
add_connection pll.c3 pw_gen_4.clock clock
add_connection pll.c3 pw_gen_5.clock clock
add_connection pll.c3 pw_gen_6.clock clock
add_connection pll.c3 pw_gen_7.clock clock
add_connection pll.c3 pw_gen_8.clock clock
add_connection pll.c3 pw_gen_9.clock clock
add_connection pll.c3 pw_gen_10.clock clock
add_connection pll.c3 pw_gen_11.clock clock
add_connection pll.c3 pw_gen_12.clock clock
add_connection pll.c3 pw_gen_13.clock clock
add_connection pll.c3 pw_gen_14.clock clock
add_connection pll.c3 pw_gen_15.clock clock
add_connection pll.c3 pw_gen_16.clock clock
add_connection pll.c3 pw_gen_17.clock clock
add_connection pll.c3 pw_gen_18.clock clock
add_connection pll.c3 pw_gen_19.clock clock
add_connection pll.c3 pw_gen_20.clock clock
add_connection pll.c3 pw_gen_21.clock clock
add_connection pll.c3 pw_gen_22.clock clock
add_connection pll.c3 pw_gen_23.clock clock
add_connection pll.c3 pw_gen_24.clock clock
add_connection pll.c3 pw_gen_25.clock clock
add_connection pll.c3 pw_gen_26.clock clock
add_connection pll.c3 pw_gen_27.clock clock
add_connection pll.c3 pw_gen_28.clock clock
add_connection pll.c3 pw_gen_29.clock clock
add_connection pll.c3 pw_gen_30.clock clock
add_connection pll.c3 pw_gen_31.clock clock
add_connection pll.c3 pw_mem_0.clk2 clock
add_connection pll.c3 pw_mem_1.clk2 clock
add_connection pll.c3 pw_mem_2.clk2 clock
add_connection pll.c3 pw_mem_3.clk2 clock
add_connection pll.c3 pw_mem_4.clk2 clock
add_connection pll.c3 pw_mem_5.clk2 clock
add_connection pll.c3 pw_mem_6.clk2 clock
add_connection pll.c3 pw_mem_7.clk2 clock
add_connection pll.c3 pw_mem_8.clk2 clock
add_connection pll.c3 pw_mem_9.clk2 clock
add_connection pll.c3 pw_mem_10.clk2 clock
add_connection pll.c3 pw_mem_11.clk2 clock
add_connection pll.c3 pw_mem_12.clk2 clock
add_connection pll.c3 pw_mem_13.clk2 clock
add_connection pll.c3 pw_mem_14.clk2 clock
add_connection pll.c3 pw_mem_15.clk2 clock
add_connection pll.c3 pw_mem_16.clk2 clock
add_connection pll.c3 pw_mem_17.clk2 clock
add_connection pll.c3 pw_mem_18.clk2 clock
add_connection pll.c3 pw_mem_19.clk2 clock
add_connection pll.c3 pw_mem_20.clk2 clock
add_connection pll.c3 pw_mem_21.clk2 clock
add_connection pll.c3 pw_mem_22.clk2 clock
add_connection pll.c3 pw_mem_23.clk2 clock
add_connection pll.c3 pw_mem_24.clk2 clock
add_connection pll.c3 pw_mem_25.clk2 clock
add_connection pll.c3 pw_mem_26.clk2 clock
add_connection pll.c3 pw_mem_27.clk2 clock
add_connection pll.c3 pw_mem_28.clk2 clock
add_connection pll.c3 pw_mem_29.clk2 clock
add_connection pll.c3 pw_mem_30.clk2 clock
add_connection pll.c3 pw_mem_31.clk2 clock
add_connection reset_bridge_0.out_reset hollywood_hash_core_0.reset reset
add_connection reset_bridge_0.out_reset hollywood_hash_core_1.reset reset
add_connection reset_bridge_0.out_reset hollywood_hash_core_2.reset reset
add_connection reset_bridge_0.out_reset hollywood_hash_core_3.reset reset
add_connection reset_bridge_0.out_reset hollywood_hash_core_4.reset reset
add_connection reset_bridge_0.out_reset hollywood_hash_core_5.reset reset
add_connection reset_bridge_0.out_reset hollywood_hash_core_6.reset reset
add_connection reset_bridge_0.out_reset hollywood_hash_core_7.reset reset
add_connection reset_bridge_0.out_reset hollywood_hash_core_8.reset reset
add_connection reset_bridge_0.out_reset hollywood_hash_core_9.reset reset
add_connection reset_bridge_0.out_reset hollywood_hash_core_10.reset reset
add_connection reset_bridge_0.out_reset hollywood_hash_core_11.reset reset
add_connection reset_bridge_0.out_reset hollywood_hash_core_12.reset reset
add_connection reset_bridge_0.out_reset hollywood_hash_core_13.reset reset
add_connection reset_bridge_0.out_reset hollywood_hash_core_14.reset reset
add_connection reset_bridge_0.out_reset hollywood_hash_core_15.reset reset
add_connection reset_bridge_0.out_reset hollywood_hash_core_16.reset reset
add_connection reset_bridge_0.out_reset hollywood_hash_core_17.reset reset
add_connection reset_bridge_0.out_reset hollywood_hash_core_18.reset reset
add_connection reset_bridge_0.out_reset hollywood_hash_core_19.reset reset
add_connection reset_bridge_0.out_reset hollywood_hash_core_20.reset reset
add_connection reset_bridge_0.out_reset hollywood_hash_core_21.reset reset
add_connection reset_bridge_0.out_reset hollywood_hash_core_22.reset reset
add_connection reset_bridge_0.out_reset hollywood_hash_core_23.reset reset
add_connection reset_bridge_0.out_reset hollywood_hash_core_24.reset reset
add_connection reset_bridge_0.out_reset hollywood_hash_core_25.reset reset
add_connection reset_bridge_0.out_reset hollywood_hash_core_26.reset reset
add_connection reset_bridge_0.out_reset hollywood_hash_core_27.reset reset
add_connection reset_bridge_0.out_reset hollywood_hash_core_28.reset reset
add_connection reset_bridge_0.out_reset hollywood_hash_core_29.reset reset
add_connection reset_bridge_0.out_reset hollywood_hash_core_30.reset reset
add_connection reset_bridge_0.out_reset hollywood_hash_core_31.reset reset
add_connection reset_bridge_0.out_reset jtag_uart.reset reset
add_connection reset_bridge_0.out_reset leds.reset reset
add_connection reset_bridge_0.out_reset mem.reset1 reset
add_connection reset_bridge_0.out_reset nios2.reset reset
add_connection reset_bridge_0.out_reset pll.inclk_interface_reset reset
add_connection reset_bridge_0.out_reset pw_gen_0.reset reset
add_connection reset_bridge_0.out_reset pw_gen_1.reset reset
add_connection reset_bridge_0.out_reset pw_gen_2.reset reset
add_connection reset_bridge_0.out_reset pw_gen_3.reset reset
add_connection reset_bridge_0.out_reset pw_gen_4.reset reset
add_connection reset_bridge_0.out_reset pw_gen_5.reset reset
add_connection reset_bridge_0.out_reset pw_gen_6.reset reset
add_connection reset_bridge_0.out_reset pw_gen_7.reset reset
add_connection reset_bridge_0.out_reset pw_gen_8.reset reset
add_connection reset_bridge_0.out_reset pw_gen_9.reset reset
add_connection reset_bridge_0.out_reset pw_gen_10.reset reset
add_connection reset_bridge_0.out_reset pw_gen_11.reset reset
add_connection reset_bridge_0.out_reset pw_gen_12.reset reset
add_connection reset_bridge_0.out_reset pw_gen_13.reset reset
add_connection reset_bridge_0.out_reset pw_gen_14.reset reset
add_connection reset_bridge_0.out_reset pw_gen_15.reset reset
add_connection reset_bridge_0.out_reset pw_gen_16.reset reset
add_connection reset_bridge_0.out_reset pw_gen_17.reset reset
add_connection reset_bridge_0.out_reset pw_gen_18.reset reset
add_connection reset_bridge_0.out_reset pw_gen_19.reset reset
add_connection reset_bridge_0.out_reset pw_gen_20.reset reset
add_connection reset_bridge_0.out_reset pw_gen_21.reset reset
add_connection reset_bridge_0.out_reset pw_gen_22.reset reset
add_connection reset_bridge_0.out_reset pw_gen_23.reset reset
add_connection reset_bridge_0.out_reset pw_gen_24.reset reset
add_connection reset_bridge_0.out_reset pw_gen_25.reset reset
add_connection reset_bridge_0.out_reset pw_gen_26.reset reset
add_connection reset_bridge_0.out_reset pw_gen_27.reset reset
add_connection reset_bridge_0.out_reset pw_gen_28.reset reset
add_connection reset_bridge_0.out_reset pw_gen_29.reset reset
add_connection reset_bridge_0.out_reset pw_gen_30.reset reset
add_connection reset_bridge_0.out_reset pw_gen_31.reset reset
add_connection reset_bridge_0.out_reset pw_mem_0.reset1 reset
add_connection reset_bridge_0.out_reset pw_mem_0.reset2 reset
add_connection reset_bridge_0.out_reset pw_mem_1.reset1 reset
add_connection reset_bridge_0.out_reset pw_mem_1.reset2 reset
add_connection reset_bridge_0.out_reset pw_mem_2.reset1 reset
add_connection reset_bridge_0.out_reset pw_mem_2.reset2 reset
add_connection reset_bridge_0.out_reset pw_mem_3.reset1 reset
add_connection reset_bridge_0.out_reset pw_mem_3.reset2 reset
add_connection reset_bridge_0.out_reset pw_mem_4.reset1 reset
add_connection reset_bridge_0.out_reset pw_mem_4.reset2 reset
add_connection reset_bridge_0.out_reset pw_mem_5.reset1 reset
add_connection reset_bridge_0.out_reset pw_mem_5.reset2 reset
add_connection reset_bridge_0.out_reset pw_mem_6.reset1 reset
add_connection reset_bridge_0.out_reset pw_mem_6.reset2 reset
add_connection reset_bridge_0.out_reset pw_mem_7.reset1 reset
add_connection reset_bridge_0.out_reset pw_mem_7.reset2 reset
add_connection reset_bridge_0.out_reset pw_mem_8.reset1 reset
add_connection reset_bridge_0.out_reset pw_mem_8.reset2 reset
add_connection reset_bridge_0.out_reset pw_mem_9.reset1 reset
add_connection reset_bridge_0.out_reset pw_mem_9.reset2 reset
add_connection reset_bridge_0.out_reset pw_mem_10.reset1 reset
add_connection reset_bridge_0.out_reset pw_mem_10.reset2 reset
add_connection reset_bridge_0.out_reset pw_mem_11.reset1 reset
add_connection reset_bridge_0.out_reset pw_mem_11.reset2 reset
add_connection reset_bridge_0.out_reset pw_mem_12.reset1 reset
add_connection reset_bridge_0.out_reset pw_mem_12.reset2 reset
add_connection reset_bridge_0.out_reset pw_mem_13.reset1 reset
add_connection reset_bridge_0.out_reset pw_mem_13.reset2 reset
add_connection reset_bridge_0.out_reset pw_mem_14.reset1 reset
add_connection reset_bridge_0.out_reset pw_mem_14.reset2 reset
add_connection reset_bridge_0.out_reset pw_mem_15.reset1 reset
add_connection reset_bridge_0.out_reset pw_mem_15.reset2 reset
add_connection reset_bridge_0.out_reset pw_mem_16.reset1 reset
add_connection reset_bridge_0.out_reset pw_mem_16.reset2 reset
add_connection reset_bridge_0.out_reset pw_mem_17.reset1 reset
add_connection reset_bridge_0.out_reset pw_mem_17.reset2 reset
add_connection reset_bridge_0.out_reset pw_mem_18.reset1 reset
add_connection reset_bridge_0.out_reset pw_mem_18.reset2 reset
add_connection reset_bridge_0.out_reset pw_mem_19.reset1 reset
add_connection reset_bridge_0.out_reset pw_mem_19.reset2 reset
add_connection reset_bridge_0.out_reset pw_mem_20.reset1 reset
add_connection reset_bridge_0.out_reset pw_mem_20.reset2 reset
add_connection reset_bridge_0.out_reset pw_mem_21.reset1 reset
add_connection reset_bridge_0.out_reset pw_mem_21.reset2 reset
add_connection reset_bridge_0.out_reset pw_mem_22.reset1 reset
add_connection reset_bridge_0.out_reset pw_mem_22.reset2 reset
add_connection reset_bridge_0.out_reset pw_mem_23.reset1 reset
add_connection reset_bridge_0.out_reset pw_mem_23.reset2 reset
add_connection reset_bridge_0.out_reset pw_mem_24.reset1 reset
add_connection reset_bridge_0.out_reset pw_mem_24.reset2 reset
add_connection reset_bridge_0.out_reset pw_mem_25.reset1 reset
add_connection reset_bridge_0.out_reset pw_mem_25.reset2 reset
add_connection reset_bridge_0.out_reset pw_mem_26.reset1 reset
add_connection reset_bridge_0.out_reset pw_mem_26.reset2 reset
add_connection reset_bridge_0.out_reset pw_mem_27.reset1 reset
add_connection reset_bridge_0.out_reset pw_mem_27.reset2 reset
add_connection reset_bridge_0.out_reset pw_mem_28.reset1 reset
add_connection reset_bridge_0.out_reset pw_mem_28.reset2 reset
add_connection reset_bridge_0.out_reset pw_mem_29.reset1 reset
add_connection reset_bridge_0.out_reset pw_mem_29.reset2 reset
add_connection reset_bridge_0.out_reset pw_mem_30.reset1 reset
add_connection reset_bridge_0.out_reset pw_mem_30.reset2 reset
add_connection reset_bridge_0.out_reset pw_mem_31.reset1 reset
add_connection reset_bridge_0.out_reset pw_mem_31.reset2 reset
add_connection reset_bridge_0.out_reset sysid_0.reset reset
add_connection nios2.data_master jtag_uart.avalon_jtag_slave avalon
set_connection_parameter_value nios2.data_master/jtag_uart.avalon_jtag_slave baseAddress 0x00010820
add_connection nios2.data_master leds.s1 avalon
set_connection_parameter_value nios2.data_master/leds.s1 baseAddress 0x00010800
add_connection nios2.data_master mem.s1 avalon
set_connection_parameter_value nios2.data_master/mem.s1 baseAddress 0x0000
add_connection nios2.data_master nios2.debug_mem_slave avalon
set_connection_parameter_value nios2.data_master/nios2.debug_mem_slave baseAddress 0x00010000
add_connection nios2.data_master pll.pll_slave avalon
set_connection_parameter_value nios2.data_master/pll.pll_slave baseAddress 0x00010810
add_connection nios2.data_master pw_gen_0.csr avalon
set_connection_parameter_value nios2.data_master/pw_gen_0.csr baseAddress 0x00020000
add_connection nios2.data_master pw_gen_1.csr avalon
set_connection_parameter_value nios2.data_master/pw_gen_1.csr baseAddress 0x00020008
add_connection nios2.data_master pw_gen_2.csr avalon
